# EAGLE design pth_supply_servos_molex (EAGLE 6.1)
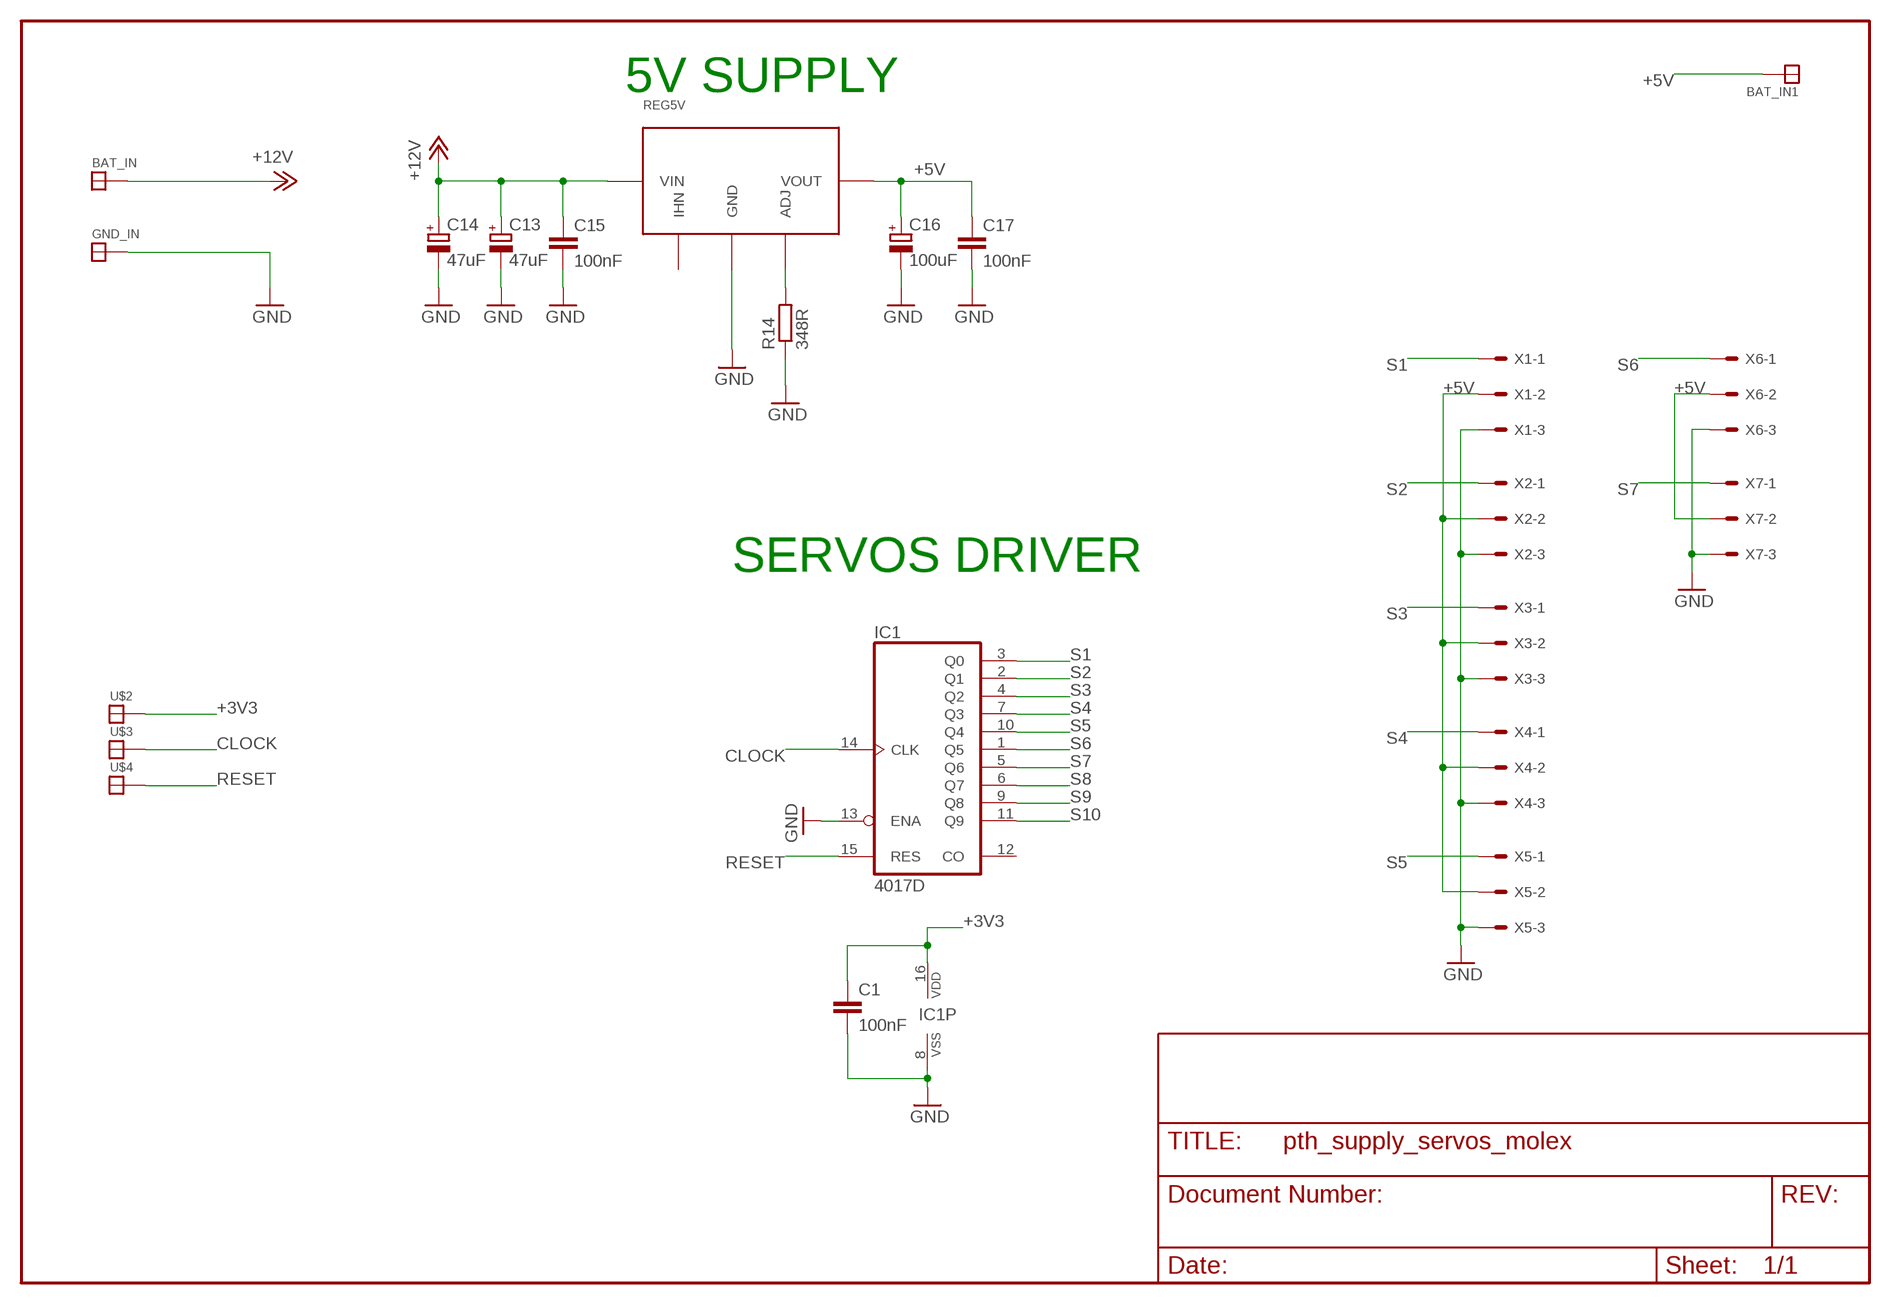
[diagram p0: schematic, sheet 1]

## Parts
BAT_IN  SOLDER_PAD150_75  [SOLD_PAD_150_75]
BAT_IN1  SOLDER_PAD150_75  [SOLD_PAD_150_75]
C1  100nF  C-EUC0805K  [C0805K]
C13  47uF  CPOL-EUSMCD  [SMC_D]
C14  47uF  CPOL-EUSMCD  [SMC_D]
C15  100nF  C-EUC0805K  [C0805K]
C16  100uF  CPOL-EUSMCD  [SMC_D]
C17  100nF  C-EUC0805K  [C0805K]
GND_IN  SOLDER_PAD150_75  [SOLD_PAD_150_75]
IC1  4017D  [SO16]
R14  348R  R-EU_R0805  [R0805]
REG5V  PTH  [PTH]
U$2  SOLDER_PAD100_50  [SOLDER_PAD_100_50]
U$3  SOLDER_PAD100_50  [SOLDER_PAD_100_50]
U$4  SOLDER_PAD100_50  [SOLDER_PAD_100_50]
X1  53047-03  [53047-03]
X2  53047-03  [53047-03]
X3  53047-03  [53047-03]
X4  53047-03  [53047-03]
X5  53047-03  [53047-03]
X6  53047-03  [53047-03]
X7  53047-03  [53047-03]

## Nets
+3V3: C1.1 IC1.16(VDD) U$2.P$1
+5V: BAT_IN1.P$1 C16.+ C17.1 REG5V.P$3(VOUT) X1.2 X2.2 X3.2 X4.2 X5.2 X6.2 X7.2
+12V: BAT_IN.P$1 C13.+ C14.+ C15.1 REG5V.P$1(VIN)
CLOCK: IC1.14(CLK) U$3.P$1
GND: C1.2 C13.- C14.- C15.2 C16.- C17.2 GND_IN.P$1 IC1.8(VSS) IC1.13(ENA) R14.1 REG5V.P$2(GND) X1.3 X2.3 X3.3 X4.3 X5.3 X6.3 X7.3
N$5: R14.2 REG5V.P$4(ADJ)
RESET: IC1.15(RES) U$4.P$1
S1: IC1.3(Q0) X1.1
S2: IC1.2(Q1) X2.1
S3: IC1.4(Q2) X3.1
S4: IC1.7(Q3) X4.1
S5: IC1.10(Q4) X5.1
S6: IC1.1(Q5) X6.1
S7: IC1.5(Q6) X7.1
S8: IC1.6(Q7)
S9: IC1.9(Q8)
S10: IC1.11(Q9)
Unconnected: IC1.12(CO) REG5V.P$5(IHN)

## Notes on the sheet
- 5V SUPPLY
- SERVOS DRIVER

## Library data of the parts
BAT_IN BAT_IN1 GND_IN U$2-U$4 = paparazzi:SOLDER_PAD
C1 C15 C17 = rcl:C-EU: CAPACITOR, European symbol
C13 C14 C16 = rcl:CPOL-EU: POLARIZED CAPACITOR, European symbol
IC1 = 40xx:4017: COUNTER/DIVIDER
R14 = rcl:R-EU_: RESISTOR, European symbol
REG5V = paparazzi:PTH
X1-X7 = con-molex:53?-03: CONNECTOR wire to board 1.25 mm (.049 inch) pitch header

## Board
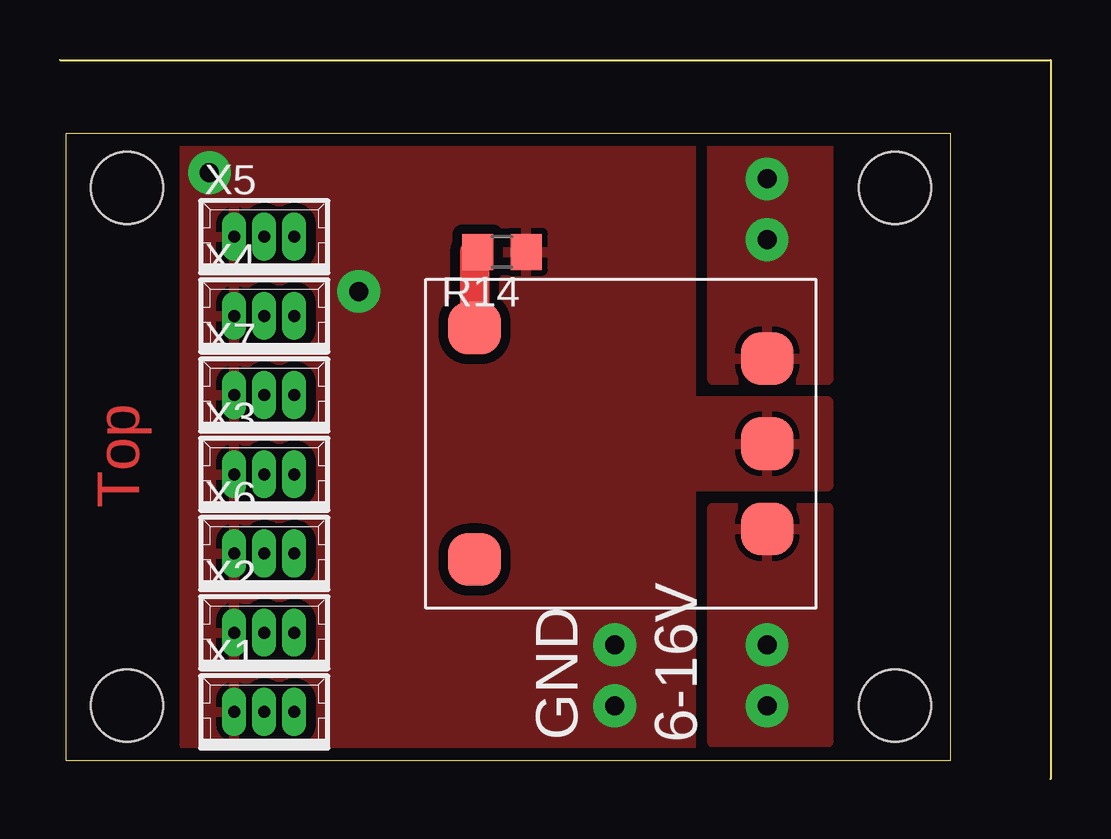
[diagram p1: board, top side]
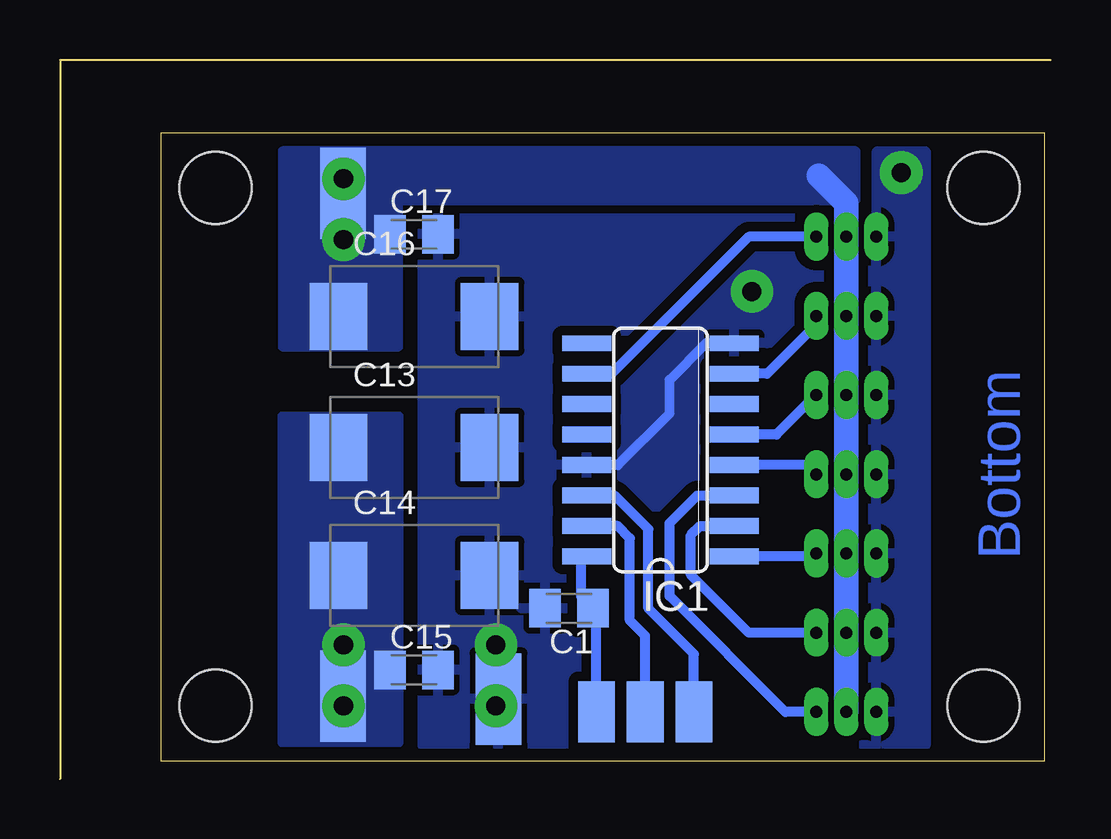
[diagram p2: board, bottom side, seen from below]

Size 41.27 x 29.97 mm. Coordinates in mm from the lower left corner, seen from the top.
Outline: 0,29.97 41.27,29.97 41.27,0
Outline: 0.25,26.92 37.08,26.92 37.08,0.76 0.25,0.76 0.25,26.92
Copper layers (1*16): Top 0.035mm / dielectric 1.5mm / Bottom 0.035mm
Design rules: minimum track width 10mil, minimum drill 19mil, track to track 8mil, track to pad 8mil, pad to pad 8mil, via to via 8mil, smd to smd 8mil, copper to edge 20mil, drill to drill 8mil, minimum pad ring 10mil, minimum via ring 8mil, stop-mask expansion 4mil, vias tented up to drill 0mil, thermal gap 10mil
Holes 3 mm at 2.79,24.64 2.79,3.05 34.8,3.05 34.8,24.64

### Footprints (pad centres in the part's own frame; a part is rotated, then mirrored left to right if it is on the bottom)
SOLD_PAD_150_75 = smd 3.81 x 1.905: P$1 0,0
C0805K = smd 1.3 x 1.6: 1 -1,0; 2 1,0
SMC_D = smd 2.4 x 2.8: + -3.15,0; - 3.15,0
SO16 = smd 0.66 x 2.032: 1 -4.445,-3.073; 2 -3.175,-3.073; 3 -1.905,-3.073; 4 -0.635,-3.073; 5 0.635,-3.073; 6 1.905,-3.073; 7 3.175,-3.073; 8 4.445,-3.073; 9 4.445,3.073; 10 3.175,3.073; 11 1.905,3.073; 12 0.635,3.073; 13 -0.635,3.073; 14 -1.905,3.073; 15 -3.175,3.073; 16 -4.445,3.073
R0805 = smd 1.3 x 1.5: 1 -1.012,0; 2 1.012,0
PTH = smd 2.184 x 2.184: P$1 -6.096,3.556; P$2 -6.096,0; P$3 -6.096,-3.556; P$4 6.096,-4.826; P$5 6.096,4.826
SOLDER_PAD_100_50 = smd 2.54 x 1.524: P$1 0,0
53047-03 = drill 0.5 pad 0.698 long: 1 1.25,0; 2 0,0; 3 -1.25,0

### Placement (x,y rotation side)
BAT_IN  29.48,3.46 90 bottom
BAT_IN1  29.48,24.41 90 bottom
C1  20.07,7.11 180 bottom
C13  26.52,13.81 0 bottom
C14  26.52,8.48 0 bottom
C15  26.52,4.54 0 bottom
C16  26.52,19.27 0 bottom
C17  26.52,22.7 0 bottom
GND_IN  23.01,3.33 90 bottom
IC1  16.26,13.72 90 bottom
R14  18.41,21.97 180 top
REG5V  23.37,13.97 180 top
U$2  18.92,2.79 90 bottom
U$3  14.86,2.79 90 bottom
U$4  16.89,2.79 270 bottom
X1  8.51,2.79 0 top
X2  8.51,6.1 0 top
X3  8.51,12.7 0 top
X4  8.51,19.3 0 top
X5  8.51,22.61 0 top
X6  8.51,9.4 0 top
X7  8.51,16 0 top

### Tracks (layer width: path | path; a pad name or v marks a point on that pad's centre or on a via)
+3V3
  Bottom 0.406: U$2.P$1 18.92,6.99 19.56,7.62 | 19.56,7.62 C1.1 | IC1.16 19.56,9.04 19.56,7.62
+5V  (via drill 0.8 pad 1.78)
  Bottom 1.016: X1.2 X2.2 X6.2 X3.2 X7.2 X4.2 X5.2 8.51,24 9.65,25.15
  Bottom 1.626: 29.97,19.56 C16.+
  other vias: 29.46,25.02 29.46,22.48
  pour Bottom (isolate 0.305, no thermals): 32,26.16 32,18.03 27.18,18.03 27.18,24.13 8.13,24.13 8.13,26.16
  pour Top: 32,26.42 32,16.64 27.18,16.64 27.18,24.26 27.18,26.42
+12V  (via drill 0.8 pad 1.78)
  other vias: 29.46,5.59 29.46,3.05
  pour Bottom (no thermals): 32,1.52 32,15.11 27.18,15.11 27.18,1.52
  pour Top: 32,11.3 32,1.52 27.18,1.52 27.18,11.3
CLOCK
  Bottom 0.406: U$3.P$1 14.86,5.21 16.76,7.11 16.76,10.41 18.16,11.81 IC1.14
GND  (via drill 0.8 pad 1.78)
  Top 0.406: REG5V.P$2 29.34,13.84
  Bottom 0.406: IC1.8 14.35,18.16 15.88,16.64 15.88,15.24 18.03,13.08 IC1.13
  other vias: 23.11,5.59 23.11,3.05 12.45,20.32 6.22,25.27
  pour Top (isolate 0.406): 5.21,26.42 26.29,26.42 26.29,15.75 32,15.75 32,12.19 26.29,12.19 26.29,1.4 5.21,1.4
  pour Bottom (isolate 0.406): 26.16,23.37 7.24,23.37 7.24,26.16 5.21,26.16 5.21,1.4 26.16,1.4
N$1  (via drill 0.8 pad 1.78)
  other vias: 2.79,24.64
N$2  (via drill 0.8 pad 1.78)
  other vias: 2.79,3.05
N$3  (via drill 0.8 pad 1.78)
  other vias: 34.8,3.05
N$4  (via drill 0.8 pad 1.78)
  other vias: 34.8,24.64
N$5
  Top 1.219: R14.2 17.27,21.97 REG5V.P$4
RESET
  Bottom 0.406: IC1.15 18.03,10.54 17.53,10.03 17.53,6.6 16.89,5.97 U$4.P$1
S1
  Bottom 0.406: IC1.3 14.73,11.81 15.88,10.67 15.88,7.62 11.05,2.79 X1.1
S2
  Bottom 0.406: 13.08,10.54 IC1.2 14.61,10.54 14.99,10.16 14.99,8.51 12.57,6.1 X2.1
S3
  Bottom 0.406: X3.1 9.78,12.7 10.16,13.08 IC1.4
S4
  Bottom 0.406: X4.1 9.76,18.94 11.81,16.89 IC1.7
S5
  Bottom 0.406: 19.43,16.89 IC1.10 18.29,16.89 12.57,22.61 X5.1
S6
  Bottom 0.406: X6.1 9.78,9.4 9.91,9.27 IC1.1
S7
  Bottom 0.406: X7.1 9.78,16 11.43,14.35 IC1.5
S10
  Bottom 0.406: IC1.11 19.3,15.62

### Text on the board
Top: Top
Bottom: Bottom
tPlace: GND | 6-16V
tDocu: 5 | 4 | 7 | 3 | 6 | 2 | Paparazzi | PTH08080 Servos 1.0 | 07/02 by J & Poine | 1